# Altium schematic sheet [1] - Layout Information.SchDoc: Layout Information
size A4 portrait; ApprovedBy: Team 7; CheckedBy: Charitonidis A.; Author: Charitonidis Alexandros; CompanyName: SMAQ; DrawnBy: Charitonidis A.; Engineer: Charitonidis Alexandros; Organization: SMAQ; Address1: Glasgow; DocumentNumber: SCH-000; Revision: 1.1; SheetNumber: 1; SheetTotal: 6
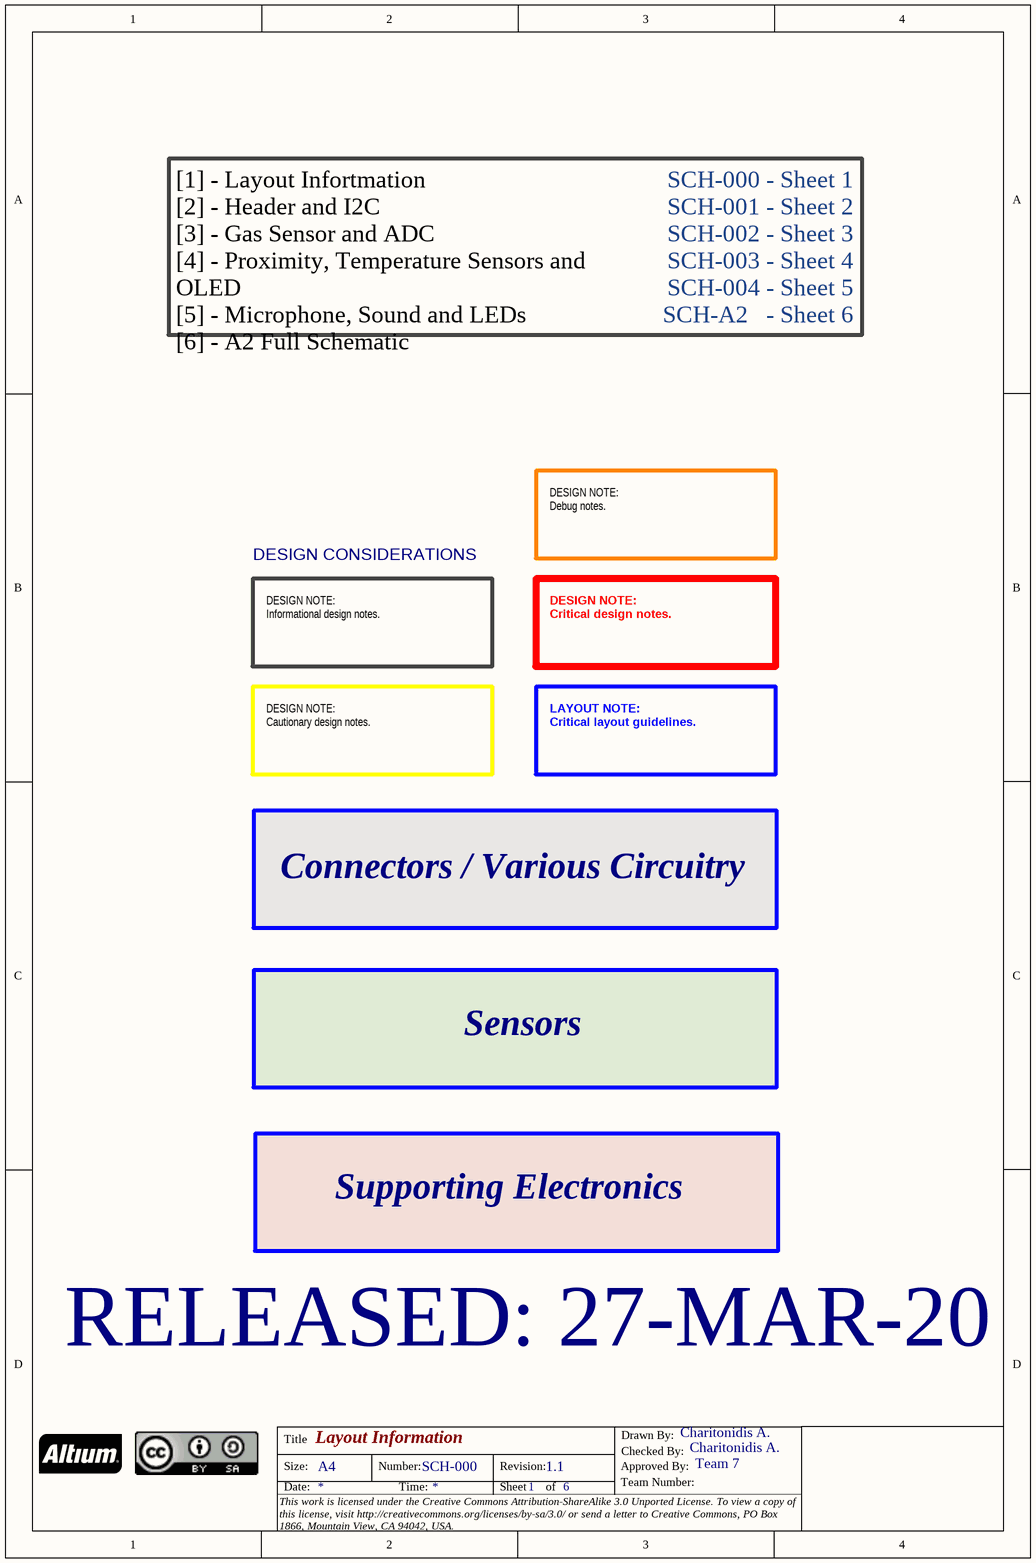
[diagram p0: [1] - Layout Information.SchDoc]

## Notes on the sheet
- SCH-000 - Sheet 1
  SCH-001 - Sheet 2
  SCH-002 - Sheet 3
  SCH-003 - Sheet 4
  SCH-004 - Sheet 5
  SCH-A2   - Sheet 6
- [1] - Layout Infortmation
  [2] - Header and I2C
  [3] - Gas Sensor and ADC
  [4] - Proximity, Temperature Sensors and OLED
  [5] - Microphone, Sound and LEDs
  [6] - A2 Full Schematic
- DESIGN CONSIDERATIONS
- DESIGN NOTE:
  Debug notes.
- DESIGN NOTE:
  Informational design notes.
- DESIGN NOTE:
  Critical design notes.
- DESIGN NOTE:
  Cautionary design notes.
- LAYOUT NOTE:
  Critical layout guidelines.
- Connectors / Various Circuitry
- Sensors
- Supporting Electronics
- RELEASED: 27-MAR-20
- Title
- Drawn By:
- Size:
- Date:
- A4
- Number:
- Time:
- Revision:
- Sheet
- of
- Approved By:
- Team Number:
- Checked By:
- This work is licensed under the Creative Commons Attribution-ShareAlike 3.0 Unported License. To view a copy of this license, visit http://creativecommons.org/licenses/by-sa/3.0/ or send a letter to Creative Commons, PO Box 1866, Mountain View, CA 94042, USA.